# Altium schematic sheet [4] Sensors.SchDoc: =DocumentName
size A3; ENG_APP_DATE: --/--/--; DSN_APP_DATE: --/--/--; CHK_APP_DATE: --/--/--; Organization: ORGANIZATION; Address1: R. Aprígio Veloso, 882, Universitário; Address2: Campina Grande - PB; Address3: 58429-900; DocumentNumber: 4; Revision: -; SheetNumber: 4; SheetTotal: 9; ENG_DATE: --/--/--; DSN_DATE: --/--/--; CHK_DATE: --/--/--; SCH_SCALE: 1:1
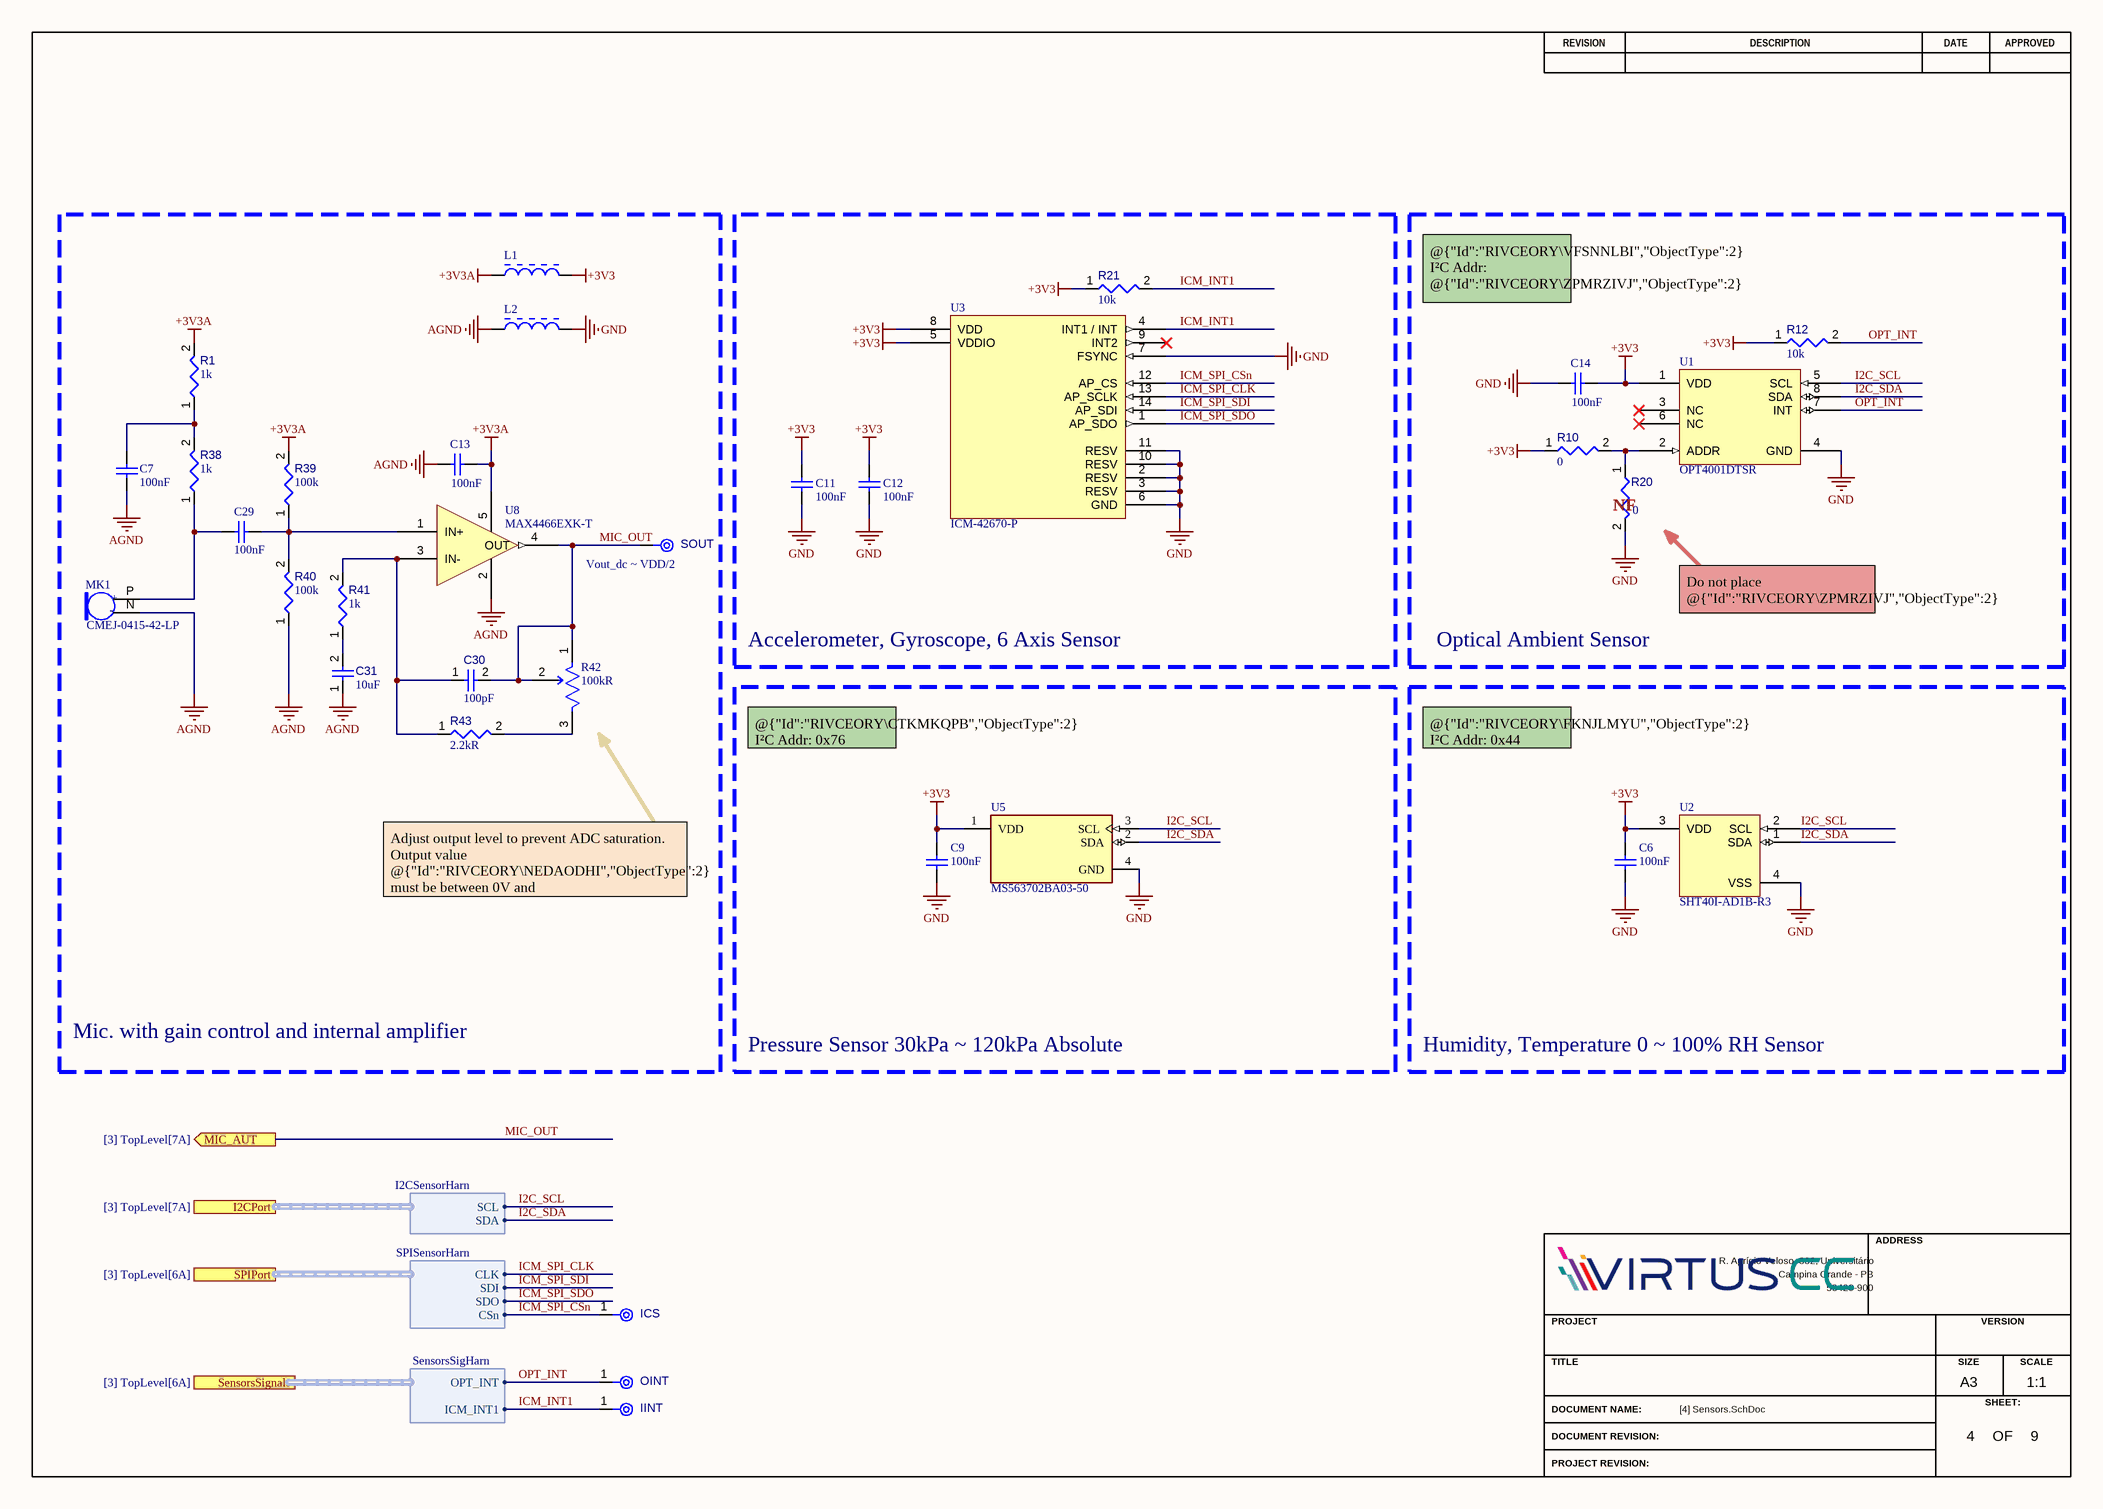
[diagram p0: [4] Sensors.SchDoc]

## Parts
C6  value 100nF  [CAPC0603(1608)100_L]  (hidden comment: VJ0603Y104MXJCW1BC)
C7  value 100nF  [CAPC0603(1608)100_L]  (hidden comment: VJ0603Y104MXJCW1BC)
C9  value 100nF  [CAPC0603(1608)100_L]  (hidden comment: VJ0603Y104MXJCW1BC)
C11  value 100nF  [CAPC0603(1608)100_L]  (hidden comment: VJ0603Y104MXJCW1BC)
C12  value 100nF  [CAPC0603(1608)100_L]  (hidden comment: VJ0603Y104MXJCW1BC)
C13  value 100nF  [CAPC0603(1608)100_L]  (hidden comment: VJ0603Y104MXJCW1BC)
C14  value 100nF  [CAPC0603(1608)100_L]  (hidden comment: VJ0603Y104MXJCW1BC)
C29  value 100nF  [CAPC0603(1608)100_L]  (hidden comment: VJ0603Y104MXJCW1BC)
C30  value 100pF  [CAPC0603(1608)100_L]  (hidden comment: C0603C101K5GACTU)
C31  value 10uF  [CAPC0603(1608)100_L]  (hidden comment: GRM188R60J106ME47D)
ICS  TPAD6R  [TP06R]  (value not drawn)  (no BOM)
IINT  TPAD6R  [TP06R]  (value not drawn)  (no BOM)
L1  BLM21PG331SN1D  [INDC2013X105X50ML20T20]  (value not drawn)
L2  BLM21PG331SN1D  [INDC2013X105X50ML20T20]  (value not drawn)
MK1  CMEJ-0415-42-LP  [MIC_CMEJ-0415-42-LP]
OINT  TPAD6R  [TP06R]  (value not drawn)  (no BOM)
R1  value 1k  [RESC0603(1608)_L]  (hidden comment: Resistor 1k +/-1% 0603 100 mW)
R10  value 0  [RESC0603(1608)_L]  (hidden comment: Resistor 0R +/- 5% 0603 100 mW)
R12  value 10k  [RESC0603(1608)_L]  (hidden comment: Resistor 10k +/-1% 0603 100 mW)
R20  value 0  [RESC0603(1608)_L]  (hidden comment: Resistor 0R +/- 5% 0603 100 mW)
R21  value 10k  [RESC0603(1608)_L]  (hidden comment: Resistor 10k +/-1% 0603 100 mW)
R38  value 1k  [RESC0603(1608)_L]  (hidden comment: Resistor 1k +/-1% 0603 100 mW)
R39  value 100k  [RESC0603(1608)_L]  (hidden comment: Resistor 100k +/-1% 0603 100 mW)
R40  value 100k  [RESC0603(1608)_L]  (hidden comment: Resistor 100k +/-1% 0603 100 mW)
R41  value 1k  [RESC0603(1608)_L]  (hidden comment: Resistor 1k +/-1% 0603 100 mW)
R42  value 100kR  [FP-TC33X-2-MFG]  (hidden comment: TC33X-2-104E)
R43  value 2.2kR  [RESC0603(1608)_L]  (hidden comment: CRCW06032K20FKEA)
SOUT  TPAD6R  [TP06R]  (value not drawn)  (no BOM)
U1  OPT4001DTSR  [SON50P130X60-8N]
U2  SHT40I-AD1B-R3  [QFN80P150X150X55-4N]
U3  ICM-42670-P  [QFN50P300X250X81-14N]
U5  MS563702BA03-50  [FP-MS563702BA03-50-MFG]
U8  MAX4466EXK-T  [SOT65P200X110-5N]

## Blocks framed on the sheet
Mic. with gain control and internal amplifier: C7 C13 C29-C31 L1 L2 MK1 R1 R38-R43 SOUT U8
Accelerometer, Gyroscope, 6 Axis Sensor: C11 C12 R21 U3
Optical Ambient Sensor: C14 R10 R12 R20 U1
Pressure Sensor 30kPa ~ 120kPa Absolute: C9 U5
Humidity, Temperature 0 ~ 100% RH Sensor: C6 U2

## Ports
I2CPort (harness I2CSensorHarn, see [3] TopLevel[7A]), MIC_AUT (out, see [3] TopLevel[7A]), SensorsSignals (harness SensorsSigHarn, see [3] TopLevel[6A]), SPIPort (harness SPISensorHarn, see [3] TopLevel[6A])

## Harnesses
I2CSensorHarn: SCL, SDA
SPISensorHarn: CLK, SDI, SDO, CSn
SensorsSigHarn: OPT_INT, ICM_INT1

## Nets
+3V3: C6.1 C9.1 C11.2 C12.2 C14.1 L1.2 R10.1 R12.1 R21.1 U1.1(VDD) U2.3(VDD) U3.5(VDDIO) U3.8(VDD) U5.1(VDD)
+3V3A: C13.1 L1.1 R1.2 R39.2 U8.5(VCC)
AGND: C7.1 C13.2 C31.1 L2.1 MK1.N(GND) R40.1 U8.2(GND)
GND: C6.2 C9.2 C11.1 C12.1 C14.2 L2.2 R20.2 U1.4(GND) U2.4(VSS) U3.2(RESV) U3.3(RESV) U3.6(GND) U3.7(FSYNC) U3.10(RESV) U3.11(RESV) U5.4(GND)
I2C_SCL: U1.5(SCL) U2.2(SCL) U5.3(SCL) ; port I2CPort.SCL
I2C_SDA: U1.8(SDA) U2.1(SDA) U5.2(SDA) ; port I2CPort.SDA
ICM_INT1: IINT.1(TP) R21.2 U3.4(INT1_/_INT) ; port SensorsSignals.ICM_INT1
ICM_SPI_CLK: U3.13(AP_SCLK) ; port SPIPort.CLK
ICM_SPI_CSn: ICS.1(TP) U3.12(AP_CS) ; port SPIPort.CSn
ICM_SPI_SDI: U3.14(AP_SDI) ; port SPIPort.SDI
ICM_SPI_SDO: U3.1(AP_SDO) ; port SPIPort.SDO
MIC_OUT: C30.2 R42.1(CCW) R42.2(WIPER) SOUT.1(TP) U8.4(OUT) ; port MIC_AUT
OPT_INT: OINT.1(TP) R12.2 U1.7(INT) ; port SensorsSignals.OPT_INT
NetC7_2: C7.2 R1.1 R38.2
NetC29_1: C29.1 R39.1 R40.2 U8.1(IN+)
NetC29_2: C29.2 MK1.P(OUTPUT) R38.1
NetC30_1: C30.1 R41.2 R43.1 U8.3(IN-)
NetC31_2: C31.2 R41.1
NetR10_2: R10.2 R20.1 U1.2(ADDR)
NetR42_3: R42.3(CW) R43.2

Not connected (* = marked no-connect by the designer): U1 3(NC)* 6(NC)*; U3 9(INT2)*

## Notes on the sheet
- @{"Id":"RIVCEORY\VFSNNLBI","ObjectType":2}  I²C Addr:
  @{"Id":"RIVCEORY\ZPMRZIVJ","ObjectType":2} placed:  0x45
  @{"Id":"RIVCEORY\HHRDZMEH","ObjectType":2} placed: 0x44
- (near R20) NF
- (near SOUT) Vout_dc ~ VDD/2
- Do not place @{"Id":"RIVCEORY\ZPMRZIVJ","ObjectType":2} and @{"Id":"RIVCEORY\HHRDZMEH","ObjectType":2} simultaneously.
- @{"Id":"RIVCEORY\CTKMKQPB","ObjectType":2} I²C Addr: 0x76
- @{"Id":"RIVCEORY\FKNJLMYU","ObjectType":2} I²C Addr: 0x44
- Adjust output level to prevent ADC saturation. Output value @{"Id":"RIVCEORY\NEDAODHI","ObjectType":2} must be between 0V and @{"Id":"UWLTDAZK\QMLQKOEH","ObjectType":1} (2.5V according with @{"Id":"ZKKBHFZM\SRYFMNCR","ObjectType":2}).
- REVISION
- DESCRIPTION
- DATE
- APPROVED
- ADDRESS
- PROJECT
- VERSION
- TITLE
- A3
- SIZE
- SCALE
- DOCUMENT NAME:
- DOCUMENT REVISION:
- OF
- SHEET:
- PROJECT REVISION:
- (in symbol CMP-010-000001-2) +; -

## Library data of the parts
C6 C7 C9 C11-C14 C29 = CMP-001-00085-1: Multilayer Ceramic Capacitor, 0.1 uF, 16 V, ± 20%, X7R, 0603 [1608 Metric]; Dielectric Material: Tantalum; Voltage Rating: 16V; Packaging: Tape and Reel; Min Operating Temperature: -55°C; Case/Package: 0603; Length: 1.6mm; Termination: SMD/SMT; Height: 0.95mm; Mounting Technology: Surface Mount; Width: 0.8mm; Case Code (Imperial): 0603; Construction: Flat; Lead Free: Lead Free; Package Quantity: 4000; Max Operating Temperature: 125°C; Dielectric: X7R; RoHS Compliant: Yes; Depth: 0.8mm; Tolerance: 20%; Series: VJ; Case Code (Metric): 1608; Voltage Rating (DC): 16V
C30 = CMP-001-00088-1: Multilayer Ceramic Capacitor, 100 pF, 50 V, ï¿½ 10%, C0G (NP0), 0603 [1608 Metric]; Dissipation Factor: 0.1%; Voltage Rating: 50V; Temperature Coefficient: 30ppm/°C; Min Operating Temperature: -55°C; Dielectric Material: Ceramic; Case/Package: 0603; Depth: 0.8mm; Mounting Technology: Surface Mount,PCB; Tolerance: 10%; Dielectric: C0G; Case Code (Metric): 1608; Height: 0.8mm; RoHS Compliant: Yes; Termination: SMD/SMT; Max Operating Temperature: 125°C; Length: 1.6mm; Packaging: Tape and Reel; Radiation Hardening: No; Voltage Rating (DC): 50V; Package Quantity: 1; Lead Free: Lead Free; Construction: Flat; Lead Pitch: 0.7mm; Series: C; Thickness: 0.034inch; Reach SVHC Compliant: No; Width: 0.031inch; Material: Ceramic; Case Code (Imperial): 0603
C31 = CMP-001-00087-1: Multilayer Ceramic Capacitor, 10 uF, 6.3 V, ± 20%, X5R, 0603 [1608 Metric]; Voltage Rating: 6.3V; Case/Package: 0603; Series: GRM; Mounting Technology: Surface Mount; RoHS Compliant: Yes; Package Quantity: 4000; Case Code (Metric): 1608; Dielectric: X5R; Weight: 0.000222oz; Max Operating Temperature: 85°C; Width: 0.8mm; Termination: Standard; Height: 0.8mm; Tolerance: 20%; Voltage Rating (DC): 6.3V; Length: 1.6mm; Min Operating Temperature: -55°C; Packaging: Cut Tape; Lead Free: Lead Free; Case Code (Imperial): 0603
ICS IINT OINT SOUT = CMP-00028-00002-2: 0.6mm round; Pins: 1
L1 L2 = CMP-006-00000-3: IND, Chip Ferrite Bead, 330 Ohm, +/- 25%, 1.5 A, -55 to 125 degC, 0805 (2012 Metric), Tape and Reel; Manufacturer: Murata; Current Rating: 1.5A; Impedance: 330Ohm; Resistance: 90mohm; Max Operating Temperature: 125°C; Core Material: Ferrite; Case/Package: 0805; Mounting Technology: SM; Datasheet URL: http://psearch.en.murata.com/inductor/product/LQG15HS15NJ02_.pdf; Packaging: TapeandReel; Min Operating Temperature: -55°C; RoHS Compliant: True; Max Current Rating: 1.5A; Datasheet Version: Nov-11; Package Quantity: 4000; Package Reference: 0805; Package Description: 2-Pin Surface Mount Device, Body 2 x1.25 mm; Tolerance: 25%
MK1 = CMP-010-000001-2: 4.0 mm, Omnidirectional, PCB Mount, 2.0 Vdc, Elecret Condenser Microphone; Frequency: 100Hz; Shape: Circular; Operating Supply Current: 500uA; Voltage Rating: 2V; Output Type: Analog; Clock Frequency: 10kHz; MF: {'manufacturer': u'CUI'}; Value: *; Termination: PC Pins; Availability: Unavailable; Width: 4mm; Design Item ID: CMEJ-0415-42-LP; Series: CMEJ; Direction: Omnidirectional; Pin Count: 2; Price: None; Component Type: Standard; Package: None; MP: CMEJ-0415-42-LP; Operating Supply Voltage: 2V; Length: 4mm; Height: 1.5mm; Source: CMEJ-0415-42-LP.SchLib
R1 R38 R41 = CMP-009-00014-6: Chip Resistor, 1 KOhm, +/-1%, 0.1 W, -55 to 155 degC, 0603 (1608 Metric); Power: 100mW; Tolerance: 1%; Voltage Rating: 50V; Mounting Technology: SM; Case/Package: 0603; Min Operating Temperature: -55°C; RoHS Compliant: True; Max Operating Temperature: 155°C; Pins: 2
R10 R20 = CMP-009-00006-6: Chip Resistor, 0 Ohm, 0.1 W, -55 to 155 degC, 0603 (1608 Metric); Power: 100mW; Voltage Rating: 50V; Tolerance: 5%; Mounting Technology: SM; RoHS Compliant: True; Max Operating Temperature: 155°C; Min Operating Temperature: -55°C; Case/Package: 0603; Pins: 2
R12 R21 = CMP-009-00017-7: Chip Resistor, 10 KOhm, +/- 1%, 01 W, -55 to 155 degC, 0603 (1608 Metric); Voltage Rating: 50V; Power: 100mW; RoHS Compliant: True; Min Operating Temperature: -55°C; Pins: 2; Case/Package: 0603; Mounting Technology: SM; Max Operating Temperature: 155°C; Tolerance: 1%
R39 R40 = CMP-009-00023-6: Chip Resistor, 100 KOhm, +/- 1%, 0.1 W, -55 to 155 degC, 0603 (1608 Metric); Power: 100mW; Voltage Rating: 50V; Tolerance: 1%; RoHS Compliant: True; Pins: 2; Min Operating Temperature: -55°C; Case/Package: 0603; Max Operating Temperature: 155°C; Mounting Technology: SM
R42 = CMP-009-00187-1: Cermet trimmer potentiometer, 100 kΩ, 0.1 W, SMD, on top, TC33X-2-104E; Resistance Tolerance: 25%; Voltage Rating (DC): 50V; Power Rating: 100mW; Temperature Coefficient: 250ppm/°C; Number of Turns: 1; Mounting Technology: Surface Mount; Pins: 2; Resistor Type: Carbon,Cermet; Tolerance: 25%; Min Operating Temperature: -40°C; Radiation Hardening: No; Length: 0.15inch; Max Operating Temperature: 100°C; Height: 0.047inch; RoHS Compliant: Yes; Max Power Dissipation: 100mW; Depth: 3.8mm; Reach SVHC Compliant: No; Military Standard: Not; Series: TC33; Width: 0.118inch; Weight: 29.4mg; Termination: Foot Print; Package Quantity: 1; Packaging: Tape and Reel
R43 = CMP-009-00186-1: SMD Chip Resistor, 2.2 kOhm, ± 1%, 100 mW, 0603 [1608 Metric], Thick Film, General Purpose; Voltage Rating (DC): 75V; Max Power Dissipation: 100mW; Temperature Coefficient: 100ppm/°C; Depth: 0.85mm; Height: 0.45mm; Contact Plating: Tin; Resistance Tolerance: 1%; Ratings: AEC-Q200; Weight: 7.1E-05oz; Series: CRCW; Case Code (Imperial): 0603; Construction: Rectangular; Width: 0.033inch; Reach SVHC Compliant: Unknown; Case Code (Metric): 1608; Resistor Type: Thick Film; Packaging: Tape and Reel; Case/Package: 0603; Package Quantity: 10; RoHS Compliant: Yes; Lead Free: Lead Free; Military Standard: Not; Termination: SMD/SMT; Tolerance: 1%; Technology: THICK FILM; Max Operating Temperature: 155°C; Voltage Rating: 75V; Power Rating: 100mW; Length: 1.55mm; Number of Terminations: 2; Radiation Hardening: No; Min Operating Temperature: -55°C; Features: Automotive AEC-Q200
U1 = CMP-010-00031-2: High-speed high-precision digital ambient light sensor (ALS) 8-SOT-5X3 -40 to 85; Pins: 8; Height: 600um; Thickness: 550um; Length: 2.1mm; Width: 1.2mm
U2 = CMP-010-00033-3: Humidity And Temperature Sensor
U3 = CMP-010-00032-3: Mems Module, 1.71-3.6 V, Lga-14 Rohs Compliant: Yes; Min Operating Temperature: -40°C; Width: 3mm; Length: 2.5mm
U5 = CMP-010-00027-2: Pressure Sensor, Barometric, 300 mbar, 1200 mbar, QFN, 8, -40 C; Supply Current: 20.09uA; Min Supply Voltage: 1.8V; Max Supply Voltage: 3.6V; Pins: 8; Lead Free: Lead Free; Min Operating Temperature: -40°C; Pressure Type: Barometric; Height: 1mm; Max Operating Temperature: 85°C; Reach SVHC Compliant: No; RoHS Compliant: Yes; Packaging: Cut Tape; Case/Package: QFN
U8 = CMP-00027-00002-4: Audio Amp Microphone 1-CH Mono Class-AB 5-Pin SC-70 T/R; Gain Bandwidth Product: 600kHz; Max Supply Voltage: 5.5V; Min Supply Voltage: 2.4V; Power Supply Rejection Ratio (PSRR): 112dB; Mounting Technology: Surface Mount; Max Operating Temperature: 85°C; Radiation Hardening: No; RoHS Compliant: No; Packaging: Tape and Reel; Min Operating Temperature: -40°C; Series: -